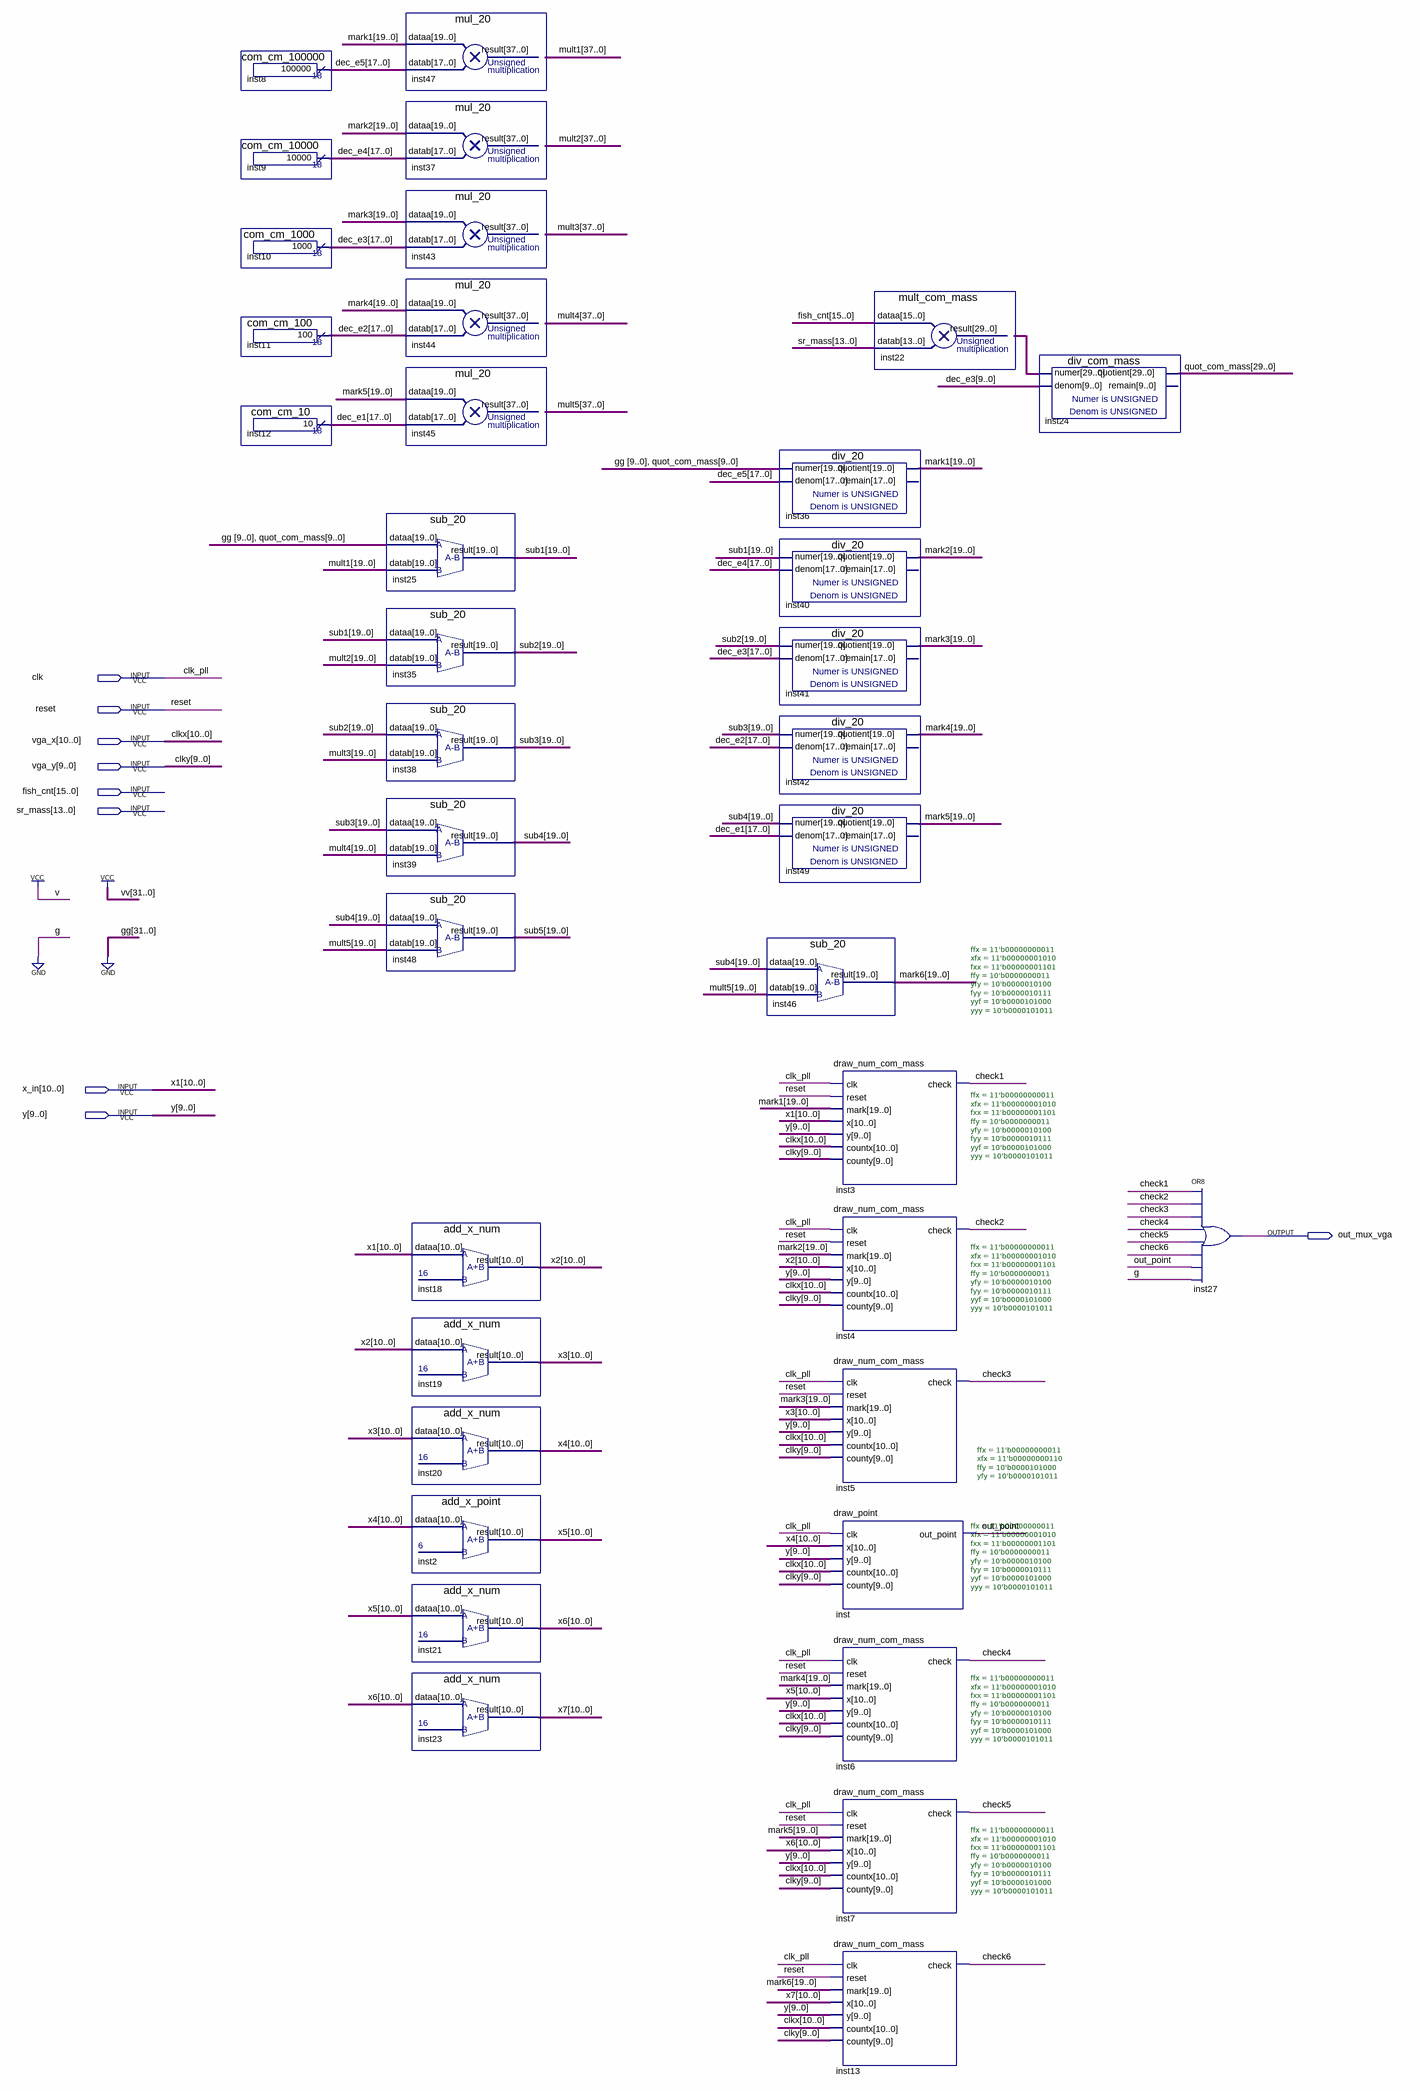
[diagram p0: schematic sheet]
// Quartus schematic num_for_com_mass.bdf as structural Verilog: 37 symbols, 9 pins
module num_for_com_mass (
  input  clk,
  input  reset,
  input  [10:0] vga_x,
  input  [9:0] vga_y,
  input  [15:0] fish_cnt,
  input  [13:0] sr_mass,
  input  [10:0] x_in,
  input  [9:0] y,
  output out_mux_vga
);

  wire check1, check2, check3, check4, check5, check6, out_point;
  wire [10:0] x2, x3, x4, x5, x6, x7;
  wire [17:0] dec_e1, dec_e2, dec_e3, dec_e4, dec_e5;
  wire [19:0] mark1, mark2, mark3, mark4, mark5, mark6, sub1, sub2, sub3, sub4, sub5;
  wire [29:0] inst22_result, quot_com_mass;
  wire [37:0] mult1, mult2, mult3, mult4, mult5;

  com_cm_100000 inst8 (.result(dec_e5));
  com_cm_10000 inst9 (.result(dec_e4));
  com_cm_1000 inst10 (.result(dec_e3));
  com_cm_100 inst11 (.result(dec_e2));
  com_cm_10 inst12 (.result(dec_e1));
  mul_20 inst47 (.dataa(mark1), .datab(dec_e5), .result(mult1));
  mul_20 inst37 (.dataa(mark2), .datab(dec_e4), .result(mult2));
  mul_20 inst43 (.dataa(mark3), .datab(dec_e3), .result(mult3));
  mul_20 inst44 (.dataa(mark4), .datab(dec_e2), .result(mult4));
  mul_20 inst45 (.dataa(mark5), .datab(dec_e1), .result(mult5));
  sub_20 inst25 (.dataa({{10{1'b0}}, quot_com_mass[9:0]}), .datab(mult1[19:0]), .result(sub1));
  sub_20 inst35 (.dataa(sub1), .datab(mult2[19:0]), .result(sub2));
  sub_20 inst38 (.dataa(sub2), .datab(mult3[19:0]), .result(sub3));
  sub_20 inst39 (.dataa(sub3), .datab(mult4[19:0]), .result(sub4));
  sub_20 inst48 (.dataa(sub4), .datab(mult5[19:0]), .result(sub5));
  add_x_num inst18 (.dataa(x_in), .result(x2));
  add_x_num inst19 (.dataa(x2), .result(x3));
  add_x_num inst20 (.dataa(x3), .result(x4));
  add_x_point inst2 (.dataa(x4), .result(x5));
  add_x_num inst21 (.dataa(x5), .result(x6));
  add_x_num inst23 (.dataa(x6), .result(x7));
  div_20 inst36 (.numer({{10{1'b0}}, quot_com_mass[9:0]}), .denom(dec_e5), .quotient(mark1));  // open: remain
  div_20 inst40 (.numer(sub1), .denom(dec_e4), .quotient(mark2));  // open: remain
  div_20 inst41 (.numer(sub2), .denom(dec_e3), .quotient(mark3));  // open: remain
  div_20 inst42 (.numer(sub3), .denom(dec_e2), .quotient(mark4));  // open: remain
  div_20 inst49 (.numer(sub4), .denom(dec_e1), .quotient(mark5));  // open: remain
  sub_20 inst46 (.dataa(sub4), .datab(mult5[19:0]), .result(mark6));
  draw_num_com_mass #(.ffx(11'b00000000011), .xfx(11'b00000001010), .fxx(11'b00000001101), .ffy(10'b0000000011), .yfy(10'b0000010100), .fyy(10'b0000010111), .yyf(10'b0000101000), .yyy(10'b0000101011)) inst3 (
    .clk(clk), .reset(reset), .mark(mark1), .x(x_in), .y(y), .countx(vga_x), .county(vga_y), .check(check1));
  draw_num_com_mass #(.ffx(11'b00000000011), .xfx(11'b00000001010), .fxx(11'b00000001101), .ffy(10'b0000000011), .yfy(10'b0000010100), .fyy(10'b0000010111), .yyf(10'b0000101000), .yyy(10'b0000101011)) inst4 (
    .clk(clk), .reset(reset), .mark(mark2), .x(x2), .y(y), .countx(vga_x), .county(vga_y), .check(check2));
  draw_num_com_mass #(.ffx(11'b00000000011), .xfx(11'b00000001010), .fxx(11'b00000001101), .ffy(10'b0000000011), .yfy(10'b0000010100), .fyy(10'b0000010111), .yyf(10'b0000101000), .yyy(10'b0000101011)) inst5 (
    .clk(clk), .reset(reset), .mark(mark3), .x(x3), .y(y), .countx(vga_x), .county(vga_y), .check(check3));
  draw_point #(.ffx(11'b00000000011), .xfx(11'b00000000110), .ffy(10'b0000101000), .yfy(10'b0000101011)) inst (
    .clk(clk), .x(x4), .y(y), .countx(vga_x), .county(vga_y), .out_point(out_point));
  draw_num_com_mass #(.ffx(11'b00000000011), .xfx(11'b00000001010), .fxx(11'b00000001101), .ffy(10'b0000000011), .yfy(10'b0000010100), .fyy(10'b0000010111), .yyf(10'b0000101000), .yyy(10'b0000101011)) inst6 (
    .clk(clk), .reset(reset), .mark(mark4), .x(x5), .y(y), .countx(vga_x), .county(vga_y), .check(check4));
  draw_num_com_mass #(.ffx(11'b00000000011), .xfx(11'b00000001010), .fxx(11'b00000001101), .ffy(10'b0000000011), .yfy(10'b0000010100), .fyy(10'b0000010111), .yyf(10'b0000101000), .yyy(10'b0000101011)) inst7 (
    .clk(clk), .reset(reset), .mark(mark5), .x(x6), .y(y), .countx(vga_x), .county(vga_y), .check(check5));
  draw_num_com_mass #(.ffx(11'b00000000011), .xfx(11'b00000001010), .fxx(11'b00000001101), .ffy(10'b0000000011), .yfy(10'b0000010100), .fyy(10'b0000010111), .yyf(10'b0000101000), .yyy(10'b0000101011)) inst13 (
    .clk(clk), .reset(reset), .mark(mark6), .x(x7), .y(y), .countx(vga_x), .county(vga_y), .check(check6));
  mult_com_mass inst22 (.dataa(fish_cnt), .datab(sr_mass), .result(inst22_result));
  div_com_mass inst24 (.numer(inst22_result), .denom(dec_e3[9:0]), .quotient(quot_com_mass));  // open: remain
  or inst27 (out_mux_vga, check1, check2, check3, check4, check5, check6, out_point, 1'b0);

  // Other names for the same wires on the sheet: clk_pll = clk; clkx[10:0] = vga_x; clky[9:0] = vga_y;
  //   x1[10:0] = x_in
endmodule
